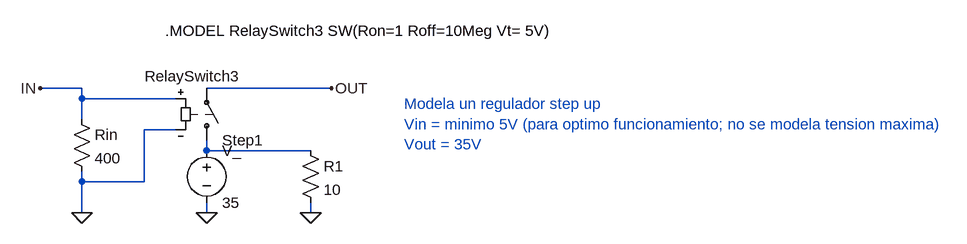
[diagram p0: schematic StepUp_ideal.asc]
StepUp_ideal.asc, the LTspice schematic file:
Version 4
SHEET 1 1424 680
WIRE 48 64 -16 64
WIRE 432 64 240 64
WIRE 48 80 48 64
WIRE 192 80 48 80
WIRE 48 112 48 80
WIRE 192 128 144 128
WIRE 240 160 240 144
WIRE 400 160 240 160
WIRE 48 208 48 192
WIRE 144 208 144 128
WIRE 144 208 48 208
WIRE 48 256 48 208
WIRE 240 256 240 240
WIRE 400 256 400 240
FLAG -16 64 IN
FLAG 432 64 OUT
FLAG 48 256 0
FLAG 240 256 0
FLAG 400 256 0
SYMBOL voltage 240 144 R0
WINDOW 123 0 0 Left 0
WINDOW 39 0 0 Left 0
SYMATTR InstName V_
SYMATTR Value 35
SYMBOL sw 240 160 M180
WINDOW 3 -95 114 Left 2
SYMATTR Value RelaySwitch3
SYMATTR InstName Step1
SYMBOL res 32 96 R0
SYMATTR InstName Rin
SYMATTR Value 400
SYMBOL res 384 144 R0
SYMATTR InstName R1
SYMATTR Value 10
TEXT 176 -24 Left 2 !.MODEL RelaySwitch3 SW(Ron=1 Roff=10Meg Vt= 5V)
TEXT 544 88 Left 2 ;Modela un regulador step up\nVin = minimo 5V (para optimo funcionamiento; no se modela tension maxima)\nVout = 35V

The netlist it stands for:
* StepUp_ideal.asc
V_ N001 0 35
Step1 N001 OUT IN 0 RelaySwitch3
Rin IN 0 400
R1 N001 0 10
.MODEL RelaySwitch3 SW(Ron=1 Roff=10Meg Vt= 5V)
* Modela un regulador step up
* Vin = minimo 5V (para optimo funcionamiento; no se modela tension maxima)
* Vout = 35V
.backanno
.end